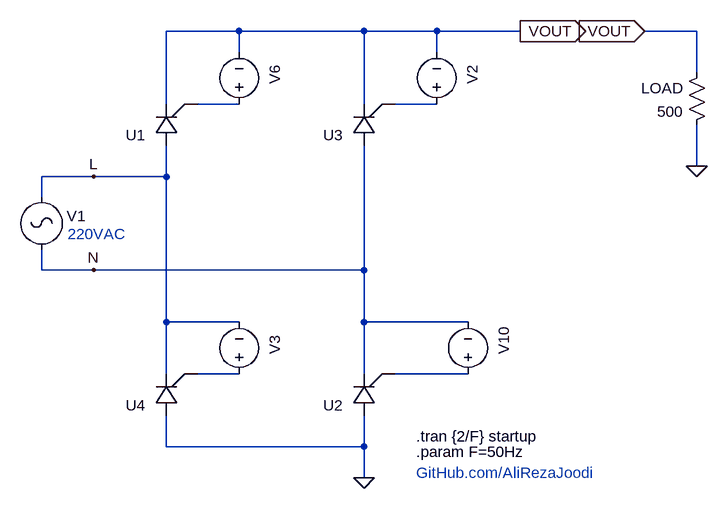
[diagram p0: schematic _Patern.asc]
_Patern.asc, the LTspice schematic file:
Version 4.1
SHEET 1 3704 2788
WIRE 320 -112 208 -112
WIRE 512 -112 320 -112
WIRE 624 -112 512 -112
WIRE 752 -112 624 -112
WIRE 1024 -112 944 -112
WIRE 320 -80 320 -112
WIRE 624 -80 624 -112
WIRE 1024 -48 1024 -112
WIRE 208 0 208 -112
WIRE 320 0 256 0
WIRE 512 0 512 -112
WIRE 624 0 560 0
WIRE 1024 96 1024 32
WIRE 96 112 16 112
WIRE 208 112 208 64
WIRE 208 112 96 112
WIRE 16 144 16 112
WIRE 16 256 16 224
WIRE 96 256 16 256
WIRE 512 256 512 64
WIRE 512 256 96 256
WIRE 208 336 208 112
WIRE 320 336 208 336
WIRE 512 336 512 256
WIRE 672 336 512 336
WIRE 208 416 208 336
WIRE 320 416 256 416
WIRE 512 416 512 336
WIRE 672 416 560 416
WIRE 208 528 208 480
WIRE 512 528 512 480
WIRE 512 528 208 528
WIRE 512 576 512 528
FLAG 96 112 L
FLAG 512 576 0
FLAG 944 -112 VOUT
IOPIN 944 -112 In
FLAG 752 -112 VOUT
IOPIN 752 -112 Out
FLAG 96 256 N
FLAG 1024 96 0
SYMBOL res 1040 -64 M0
SYMATTR InstName LOAD
SYMATTR Value 500
SYMBOL MyLib\\Voltage_AC 16 128 M0
WINDOW 123 0 0 Left 0
WINDOW 39 0 0 Left 0
WINDOW 3 41 64 Invisible 2
WINDOW 0 -68 45 Left 2
SYMATTR Value SINE(0 325 {F})
SYMATTR InstName V1
SYMBOL MyLib\\Thyristor_SCR\\S8020L 224 64 R180
WINDOW 38 48 39 Invisible 2
SYMATTR InstName U1
SYMBOL MyLib\\Thyristor_SCR\\S8020L 528 64 R180
WINDOW 38 48 39 Invisible 2
SYMATTR InstName U3
SYMBOL voltage 320 16 R180
WINDOW 3 -49 -29 Invisible 2
WINDOW 123 0 0 Left 0
WINDOW 0 -55 46 VRight 2
SYMATTR Value PULSE(0 12 5m 1n 1n 200u {1/F})
SYMATTR InstName V6
SYMATTR SpiceLine Rser=100
SYMBOL MyLib\\Thyristor_SCR\\S8020L 528 480 R180
WINDOW 38 48 39 Invisible 2
SYMATTR InstName U2
SYMBOL MyLib\\Thyristor_SCR\\S8020L 224 480 R180
WINDOW 38 48 39 Invisible 2
SYMATTR InstName U4
SYMBOL voltage 672 432 R180
WINDOW 3 -49 -29 Invisible 2
WINDOW 123 0 0 Left 0
WINDOW 0 -55 46 VRight 2
SYMATTR Value PULSE(0 12 5m 1n 1n 200u {1/F})
SYMATTR InstName V10
SYMATTR SpiceLine Rser=100
SYMBOL voltage 624 16 R180
WINDOW 3 -49 -29 Invisible 2
WINDOW 123 0 0 Left 0
WINDOW 0 -55 46 VRight 2
SYMATTR Value PULSE(0 12 15m 1n 1n 200u {1/F})
SYMATTR InstName V2
SYMATTR SpiceLine Rser=100
SYMBOL voltage 320 432 R180
WINDOW 3 -49 -29 Invisible 2
WINDOW 123 0 0 Left 0
WINDOW 0 -55 46 VRight 2
SYMATTR Value PULSE(0 12 15m 1n 1n 200u {1/F})
SYMATTR InstName V3
SYMATTR SpiceLine Rser=100
TEXT 592 512 Left 2 !.tran {2/F} startup
TEXT 56 200 Left 2 ;220VAC
TEXT 592 568 Left 2 ;GitHub.com/AliRezaJoodi
TEXT 592 536 Left 2 !.param F=50Hz

The netlist it stands for:
* _Patern.asc
R§LOAD VOUT 0 500
V1 L N SINE(0 325 {F})
X§U1 L N001 VOUT S8020L  ; pins A G K
X§U3 N N002 VOUT S8020L  ; pins A G K
V6 N001 VOUT PULSE(0 12 5m 1n 1n 200u {1/F}) Rser=100
X§U2 0 N004 N S8020L  ; pins A G K
X§U4 0 N003 L S8020L  ; pins A G K
V10 N004 N PULSE(0 12 5m 1n 1n 200u {1/F}) Rser=100
V2 N002 VOUT PULSE(0 12 15m 1n 1n 200u {1/F}) Rser=100
V3 N003 L PULSE(0 12 15m 1n 1n 200u {1/F}) Rser=100
.tran {2/F} startup
* 220VAC
* GitHub.com/AliRezaJoodi
.param F=50Hz
.lib MyLib/Thyristor_SCR/_SCR_Littelfuse.lib
.backanno
.end